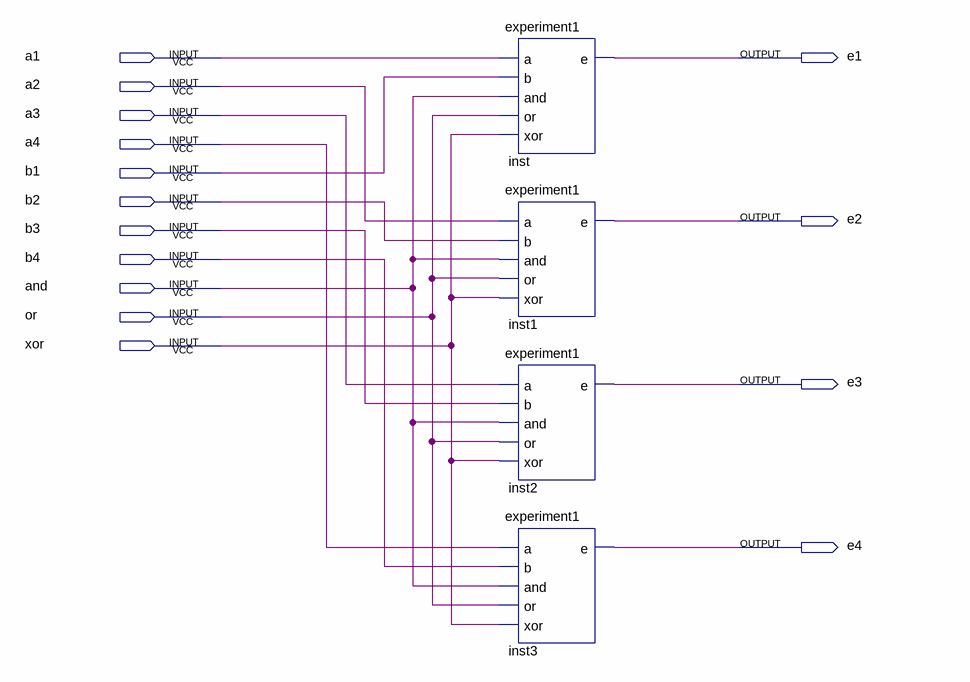
[diagram p0: schematic sheet]
// Quartus schematic experiment2.bdf as structural Verilog: 4 symbols, 15 pins
module experiment2 (
  input  a1,
  input  a2,
  input  a3,
  input  a4,
  input  b1,
  input  b2,
  input  b3,
  input  b4,
  input  \and ,
  input  \or ,
  input  \xor ,
  output e1,
  output e2,
  output e3,
  output e4
);

  experiment1 inst (.a(a1), .b(b1), .\and (\and ), .\or (\or ), .\xor (\xor ), .e(e1));
  experiment1 inst1 (.a(a2), .b(b2), .\and (\and ), .\or (\or ), .\xor (\xor ), .e(e2));
  experiment1 inst2 (.a(a3), .b(b3), .\and (\and ), .\or (\or ), .\xor (\xor ), .e(e3));
  experiment1 inst3 (.a(a4), .b(b4), .\and (\and ), .\or (\or ), .\xor (\xor ), .e(e4));
endmodule
